# EAGLE design Zio Qwiic RFID Reader_V2.0 (EAGLE 9.3.1)
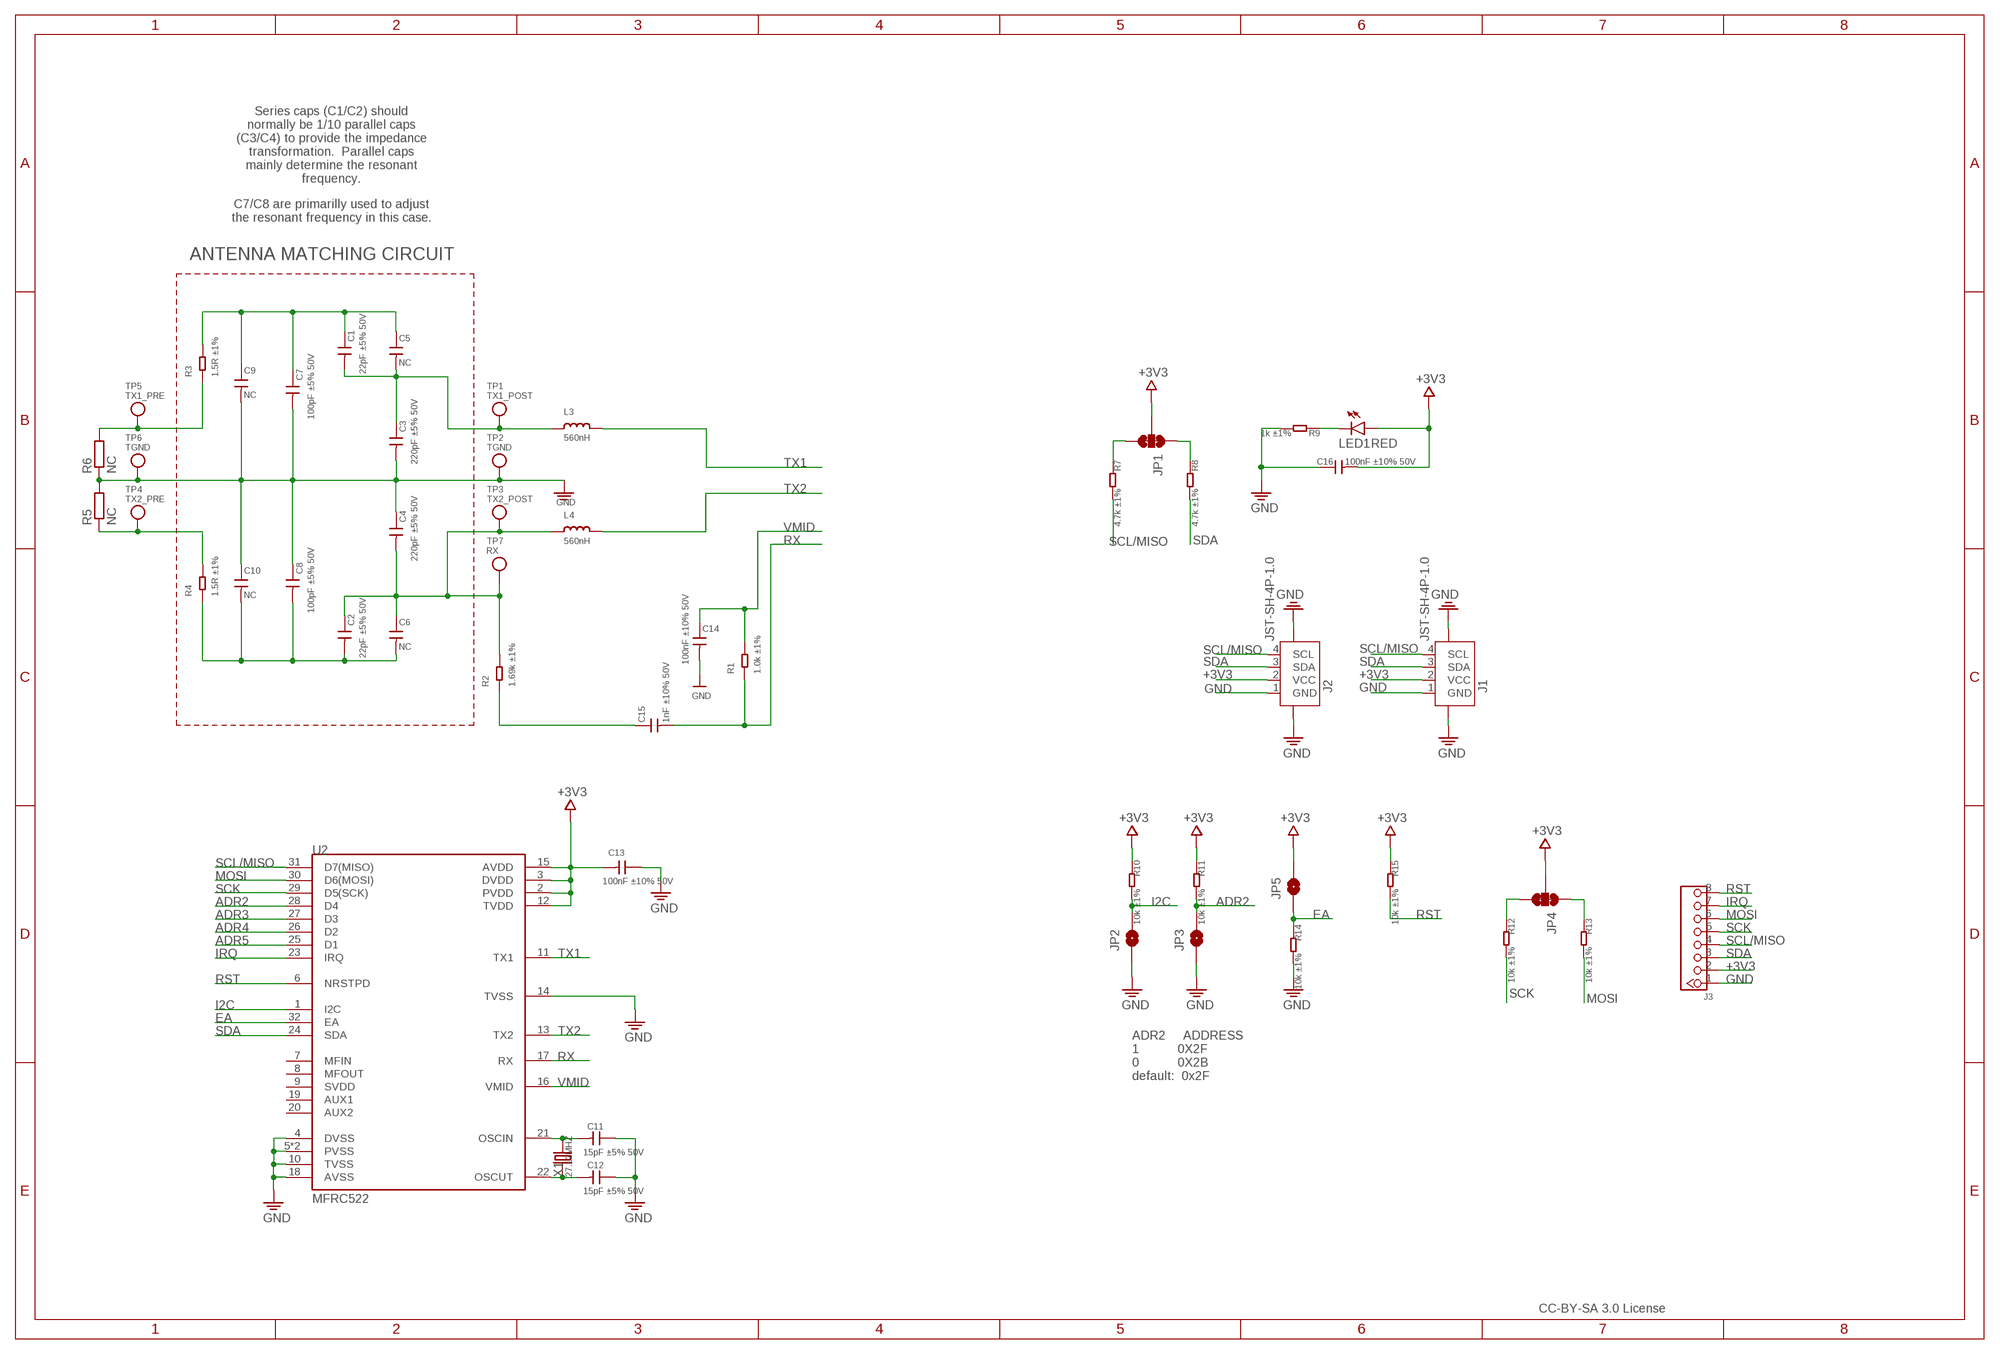
[diagram p0: schematic, sheet 1]

## Parts
C1  22pF ±5% 50V  C-0603  [C0603]
C2  22pF ±5% 50V  C-0603  [C0603]
C3  220pF ±5% 50V  C-0603  [C0603]
C4  220pF ±5% 50V  C-0603  [C0603]
C5  NC  C-0603  [C0603]
C6  NC  C-0603  [C0603]
C7  100pF ±5% 50V  C-0603  [C0603]
C8  100pF ±5% 50V  C-0603  [C0603]
C9  NC  C-0603  [C0603]
C10  NC  C-0603  [C0603]
C11  15pF ±5% 50V  C-0603  [C0603]
C12  15pF ±5% 50V  C-0603  [C0603]
C13  100nF ±10% 50V  C-0603  [C0603]
C14  100nF ±10% 50V  C-0603  [C0603]
C15  1nF ±10% 50V  C-0603  [C0603]
C16  100nF ±10% 50V  C-0603  [C0603]
J1  JST-SH-4P-1.0  [JST-SH-4P]
J2  JST-SH-4P-1.0  [JST-SH-4P]
J3  HEADER-8P-60/35MIL  [8P-2.54-60/35MIL]
JP1  SMT-JUMPER_3_2-NC_TRACE  [SMT-JUMPER_3_2-NC_TRACE]
JP2  JUMPER-SMT_2_NC_PASTE_NOCREM  [SMT-JUMPER_2_NC_PASTE_SILK_NOCREM]
JP3  JUMPER-SMT_2_NC_PASTE_NOCREM  [SMT-JUMPER_2_NC_PASTE_SILK_NOCREM]
JP4  SMT-JUMPER_3_2-NC_TRACE  [SMT-JUMPER_3_2-NC_TRACE]
JP5  JUMPER-SMT_2_NC_PASTE_NOCREM  [SMT-JUMPER_2_NC_PASTE_SILK_NOCREM]
L3  560nH  INDUCTOR0805  [0805]
L4  560nH  INDUCTOR0805  [0805]
LED1  RED  LEDCHIP-LED0603  [CHIP-LED0603]
R1  1.0k ±1%  R-0603  [R0603]
R2  1.69k ±1%  R-0603  [R0603]
R3  1.5R ±1%  R-0603  [R0603]
R4  1.5R ±1%  R-0603  [R0603]
R5  NC  R-EU_R0201  [R0201]
R6  NC  R-EU_R0201  [R0201]
R7  4.7k ±1%  R-0603  [R0603]
R8  4.7k ±1%  R-0603  [R0603]
R9  1k ±1%  R-0603  [R0603]
R10  10k ±1%  R-0603  [R0603]
R11  10k ±1%  R-0603  [R0603]
R12  10k ±1%  R-0603  [R0603]
R13  10k ±1%  R-0603  [R0603]
R14  10k ±1%  R-0603  [R0603]
R15  10k ±1%  R-0603  [R0603]
TP1  TX1_POST  TESTPOINTROUND1MM  [TESTPOINT_ROUND_1MM]
TP2  TGND  TESTPOINTROUND1MM  [TESTPOINT_ROUND_1MM]
TP3  TX2_POST  TESTPOINTROUND1MM  [TESTPOINT_ROUND_1MM]
TP4  TX2_PRE  TESTPOINTROUND1MM  [TESTPOINT_ROUND_1MM]
TP5  TX1_PRE  TESTPOINTROUND1MM  [TESTPOINT_ROUND_1MM]
TP6  TGND  TESTPOINTROUND1MM  [TESTPOINT_ROUND_1MM]
TP7  RX  TESTPOINTROUND1MM  [TESTPOINT_ROUND_1MM]
U1  MFRC522  [HVQFN32]
X1  27.12MHZ  CRYSTAL-HC49UP  [HC49UP]

## Nets
+3V3: C13.2 C16.2 J1.2(VCC) J2.2(VCC) J3.2 JP1.2 JP4.2 JP5.2 LED1.A R10.1 R11.1 R15.1 U1.2(PVDD) U1.3(DVDD) U1.12(TVDD) U1.15(AVDD)
ADR2: JP3.2 R11.2 U1.28(D4)
ADR3: U1.27(D3)
ADR4: U1.26(D2)
ADR5: U1.25(D1)
EA: JP5.1 R14.1 U1.32(EA)
GND: C3.2 C4.1 C7.2 C8.1 C9.2 C10.1 C11.1 C12.1 C13.1 C14.2 C16.1 J1.1(GND) J1.NC1 J1.NC2 J2.1(GND) J2.NC1 J2.NC2 J3.1 JP2.1 JP3.1 R5.2 R6.1 R9.2 R14.2 TP2.P$1 TP6.P$1 U1.4(DVSS) U1.5(PVSS) U1.10(TVSS) U1.14(TVSS) U1.18(AVSS) U1.33(PVSS)
I2C: JP2.2 R10.2 U1.1(I2C)
IRQ: J3.7 U1.23(IRQ)
MOSI: J3.6 R13.2 U1.30(D6(MOSI))
N$1: C12.2 U1.22(OSCUT) X1.1
N$2: C11.2 U1.21(OSCIN) X1.2
N$3: C1.2 C3.1 C5.2 L3.1 TP1.P$1
N$4: R3.1 R6.2 TP5.P$1
N$5: R4.2 R5.1 TP4.P$1
N$6: JP1.3 R7.1
N$9: C15.1 R2.1
N$12: C2.1 C4.2 C6.1 L4.1 R2.2 TP3.P$1 TP7.P$1
N$13: JP1.1 R8.1
N$14: JP4.3 R12.1
N$15: JP4.1 R13.1
N$21: LED1.C R9.1
RST: J3.8 R15.2 U1.6(NRSTPD)
RX: C15.2 R1.1 U1.17(RX)
SCK: J3.5 R12.2 U1.29(D5(SCK))
SCL/MISO: J1.4(SCL) J2.4(SCL) J3.4 R7.2 U1.31(D7(MISO))
SDA: J1.3(SDA) J2.3(SDA) J3.3 R8.2 U1.24(SDA)
TX1: L3.2 U1.11(TX1)
TX1_ANTENNA: C1.1 C5.1 C7.1 C9.1 R3.2
TX2: L4.2 U1.13(TX2)
TX2_ANTENNA: C2.2 C6.2 C8.2 C10.2 R4.1
VMID: C14.1 R1.2 U1.16(VMID)
Unconnected: U1.7(MFIN) U1.8(MFOUT) U1.9(SVDD) U1.19(AUX1) U1.20(AUX2)

## Notes on the sheet
- Series caps (C1/C2) should
  normally be 1/10 parallel caps
  (C3/C4) to provide the impedance
  transformation.  Parallel caps
  mainly determine the resonant
  frequency.
- C7/C8 are primarilly used to adjust
  the resonant frequency in this case.
- ANTENNA MATCHING CIRCUIT
- ADR2     ADDRESS
  1           0X2F
  0           0X2B
  default:  0x2F
- CC-BY-SA 3.0 License

## Library data of the parts
C1-C16 = RCL:C
J1 J2 = Connector:JST-SH-4P
J3 = Connector_NOA:HEADER-8P
JP1 JP4 = NOA-Jumpers:SMT-JUMPER_3_2-NC_TRACE
JP2 JP3 JP5 = NOA-Jumpers:JUMPER-SMT_2_NC_PASTE_NOCREM
L3 L4 = microbuilder:INDUCTOR: Inductors 0603: 10nH Ceramic Inductor - microwire antenna/RF (Digikey: 712-1434-2-ND) 0805: 560nH Ceramic Inductor - RF (Digikey: 553-1047-1-ND) 270nH Ceramic Inductor - Q = 40@250MHz, +-5%, 1 Ohm DC Resistance (Digikey: 535-10506-2-ND) 1007 (2518 Metric) SMT: 10µH 10% 250mOhm 820mA 1007 Inductor (Digikey: 587-2189-1-ND) 22µH 10% 500mOhm 580mA 1007 Inductor (Digikey: 587-2190-1-ND) 47µH 10% 950mOhm 420mA 1007 Inductor (Digikey: 587-2191-1-ND) 47µH 5% 100mOhm 1A 1008 Inductor (Digikey: 732-1816-1-ND) 5.0x5.0mm (Taiyo Yuden NR5040 Series) 6.8µH 20% 2.3A 64mOhm Inductor (Digikey: 587-2374-2-ND) 5.0x5.0mm (TDK VLC5045 Series) 4.7µH 20% 3.3A 34mOhm Inductor (Digikey: 445-6526-1-ND) 6.8µH 20% 2.7A 46mOhm Inductor (Digikey: 445-6527-1-ND) 6.0x6.0mm (TDK VLC6045 Series) 4.7µH 20% 3.8A 27mOhm Inductor (Digikey: 445-6538-2-ND) 6.8µH 20% 3A 41mOhm Inductor (Digikey: 445-6540-1-ND) 6.2µH 30% 2.2A 45mOhm Inductor (Digikey: SRR5028-6R2YCT-ND) - Not TDK VLC6045 but footprint should match 6.0x6.0mm (TDK SLF6045 Series) 6.8uH 30% 2A 33mOhm Inductor (Digikey: 445-4572-1-ND, Mouser: 810-SLF645T6R8N2R0PF) 6.0x6.0mm (Sumida CDRH5D28 Series) 6.2uH 30% 1.8A 45mOhm Inductor (Digikey: 308-1542-1-ND) Taiyo Yuden NR3015T2R2M - 2.2uH 20% 1.5A (Digikey: 587-1648-2-ND, Mouser: 963-NR3015T2R2M) - Used with TI TPS62172 CoilCraft RFID Transponder Coil - MA5532-AE (For use with AS3935 Lightning Sensor)
LED1 = led:LED: LED OSRAM: - CHIPLED LG R971, LG N971, LY N971, LG Q971, LY Q971, LO R971, LY R971 LH N974, LH R974 LS Q976, LO Q976, LY Q976 LO Q996 - Hyper CHIPLED LW Q18S LB Q993, LB Q99A, LB R99A - SideLED LS A670, LO A670, LY A670, LG A670, LP A670 LB A673, LV A673, LT A673, LW A673 LH A674 LY A675 LS A676, LA A676, LO A676, LY A676, LW A676 LS A679, LY A679, LG A679 - Hyper Micro SIDELED® LS Y876, LA Y876, LO Y876, LY Y876 LT Y87S - SmartLED LW L88C, LW L88S LB L89C, LB L89S, LG L890 LS L89K, LO L89K, LY L89K LS L896, LA L896, LO L896, LY L896 - TOPLED LS T670, LO T670, LY T670, LG T670, LP T670 LSG T670, LSP T670, LSY T670, LOP T670, LYG T670 LG T671, LOG T671, LSG T671 LB T673, LV T673, LT T673, LW T673 LH T674 LS T676, LA T676, LO T676, LY T676, LB T676, LH T676, LSB T676, LW T676 LB T67C, LV T67C, LT T67C, LS T67K, LO T67K, LY T67K, LW E67C LS E67B, LA E67B, LO E67B, LY E67B, LB E67C, LV E67C, LT E67C LW T67C LS T679, LY T679, LG T679 LS T770, LO T770, LY T770, LG T770, LP T770 LB T773, LV T773, LT T773, LW T773 LH T774 LS E675, LA E675, LY E675, LS T675 LS T776, LA T776, LO T776, LY T776, LB T776 LHGB T686 LT T68C, LB T68C - Hyper Mini TOPLED® LB M676 - Mini TOPLED Santana® LG M470 LS M47K, LO M47K, LY M47K Source: http://www.osram.convergy.de LUXEON: - LUMILED® LXK2-PW12-R00, LXK2-PW12-S00, LXK2-PW14-U00, LXK2-PW14-V00 LXK2-PM12-R00, LXK2-PM12-S00, LXK2-PM14-U00 LXK2-PE12-Q00, LXK2-PE12-R00, LXK2-PE12-S00, LXK2-PE14-T00, LXK2-PE14-U00 LXK2-PB12-K00, LXK2-PB12-L00, LXK2-PB12-M00, LXK2-PB14-N00, LXK2-PB14-P00, LXK2-PB14-Q00 LXK2-PR12-L00, LXK2-PR12-M00, LXK2-PR14-Q00, LXK2-PR14-R00 LXK2-PD12-Q00, LXK2-PD12-R00, LXK2-PD12-S00 LXK2-PH12-R00, LXK2-PH12-S00 LXK2-PL12-P00, LXK2-PL12-Q00, LXK2-PL12-R00 Source: www.luxeon.com KINGBRIGHT: KA-3528ASYC Source: www.kingbright.com
R1-R4 R7-R15 = RCL:R
R5 R6 = rcl:R-EU_: RESISTOR, European symbol
TP1-TP7 = microbuilder:TESTPOINT: Test Point Various test points for characterisation and PCB testing TESTPOINT_SMT - Compact Surface Mount Test Point [Digikey: 5016KTR-ND]
U1 = IC:MFRC522
X1 = Discrete_NOA:CRYSTAL*: CRYSTAL

## Net classes
0 default: clearance 0.205 mm

## Board
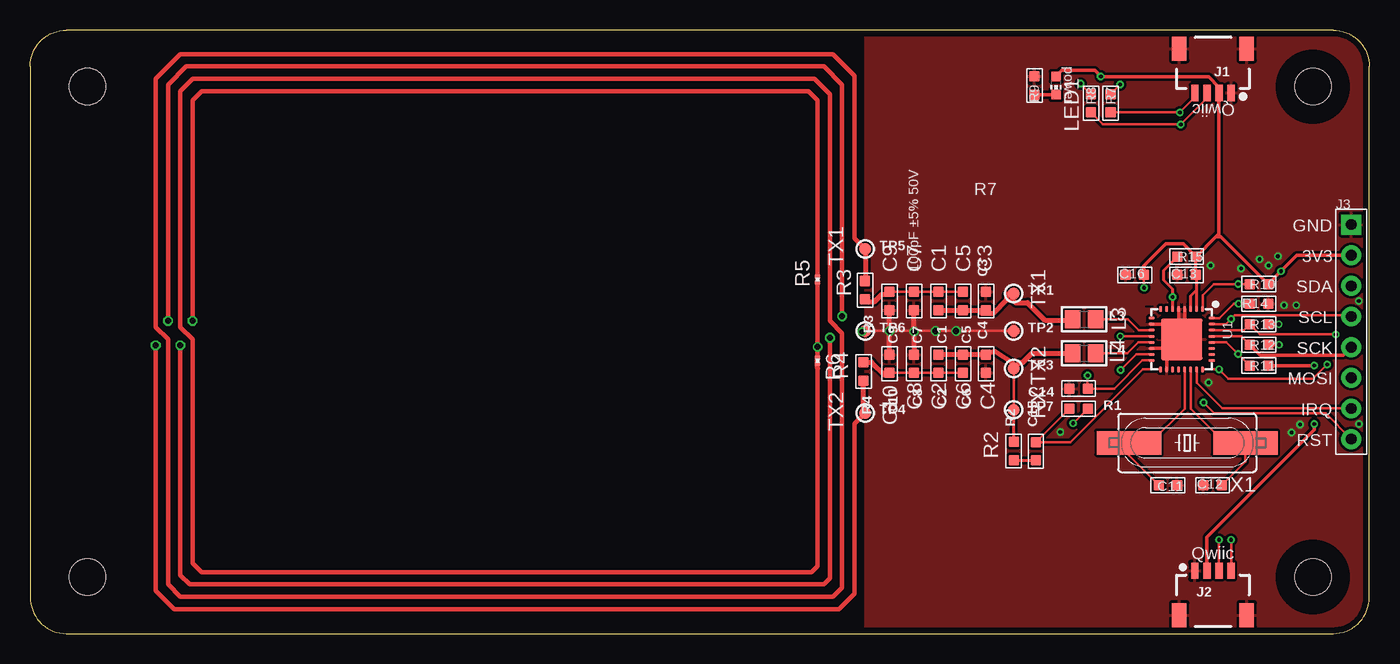
[diagram p1: board, top side]
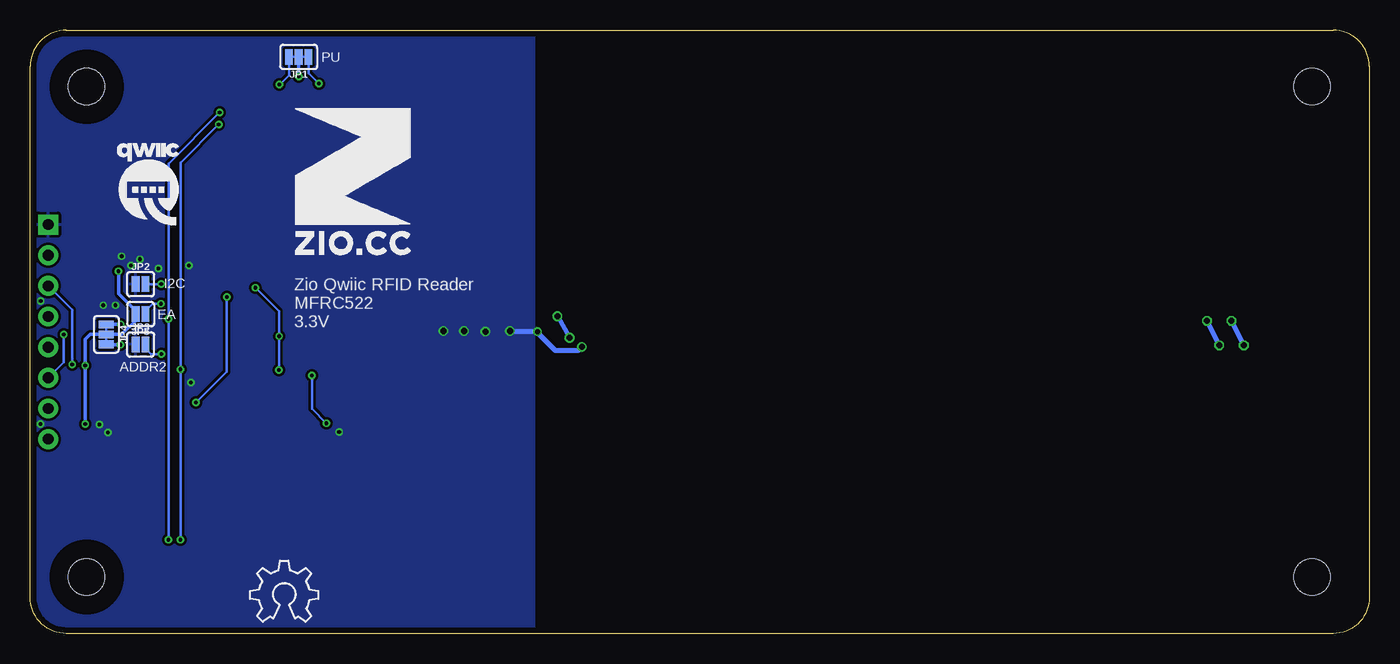
[diagram p2: board, bottom side, seen from below]

Size 111.02 x 50 mm. Coordinates in mm from the lower left corner, seen from the top.
Outline: 108.02,50 3,50 arc90 0,47 0,3 arc90 3,0 108.02,0 arc90 111.02,3 111.02,47 arc90 108.02,50
Copper layers (1*16): Top 0.035mm / dielectric 1.5mm / Bottom 0.035mm
Design rules "NOA Eagle Rule": minimum track width 7mil, minimum drill 12mil, track to track 7mil, track to pad 7mil, pad to pad 7mil, via to via 7mil, smd to smd 0mil, copper to edge 20mil, drill to drill 10mil, minimum pad ring 10mil, minimum via ring 6mil, stop-mask expansion 2mil, vias tented up to drill 25mil, thermal gap 10mil
Holes 3 mm at 4.74,4.68 4.74,45.32 106.34,4.68 106.34,45.32
tRestrict: area 92.5,27.1 to 93.1,27.2; area 93.5,24.4 to 93.7,24.9; area 95.5,26.7 to 96,26.9; area 97.8,24.4 to 98,24.9; area 95.2,22.4 to 96.3,22.6; area 103.3,1.7 to 109.3,7.7; area 103.3,42.3 to 109.3,48.3
bRestrict: area 9.1,26.9 to 14.2,28.2; area 9.1,22.1 to 14.2,23.4; area 14.7,6.3 to 64,44.2; area 103.3,1.7 to 109.3,7.7; area 103.3,42.3 to 109.3,48.3

### Footprints (pad centres in the part's own frame; a part is rotated, then mirrored left to right if it is on the bottom)
C0603 = smd 0.889 x 0.889: 1 -0.762,0; 2 0.762,0
JST-SH-4P = smd 0.6 x 1.35: 1 1.5,0; 2 0.5,0; 3 -0.5,0; 4 -1.5,0 | smd 1.2 x 2: NC1 -2.8,3.675; NC2 2.8,3.675
8P-2.54-60/35MIL = drill 0.889 pad 1.651 square: 1 0,8.89 | drill 0.889 pad 1.651: 2 0,6.35; 3 0,3.81; 4 0,1.27; 5 0,-1.27; 6 0,-3.81; 7 0,-6.35; 8 0,-8.89
SMT-JUMPER_3_2-NC_TRACE = smd 0.635 x 1.27: 1 -0.813,0; 2 0,0; 3 0.813,0
SMT-JUMPER_2_NC_PASTE_SILK_NOCREM = smd 0.635 x 1.27: 1 -0.406,0; 2 0.406,0
0805 = smd 1.3 x 1.5: 1 -0.95,0; 2 0.95,0
CHIP-LED0603 = smd 0.8 x 0.8: A 0,-0.75; C 0,0.75
R0603 = smd 0.889 x 0.889: 1 -0.762,0; 2 0.762,0
R0201 = smd 0.28 x 0.43: 1 -0.255,0; 2 0.255,0
TESTPOINT_ROUND_1MM = smd 1 x 1: P$1 0,0
HVQFN32 = smd 0.5 x 0.25: 1 -2.5,1.75; 2 -2.5,1.25; 3 -2.5,0.75; 4 -2.5,0.25; 5 -2.5,-0.25; 6 -2.5,-0.75; 7 -2.5,-1.25; 8 -2.5,-1.75; 17 2.5,-1.75; 18 2.5,-1.25; 19 2.5,-0.75; 20 2.5,-0.25; 21 2.5,0.25; 22 2.5,0.75; 23 2.5,1.25; 24 2.5,1.75 | smd 0.25 x 0.5: 9 -1.75,-2.5; 10 -1.25,-2.5; 11 -0.75,-2.5; 12 -0.25,-2.5; 13 0.25,-2.5; 14 0.75,-2.5; 15 1.25,-2.5; 16 1.75,-2.5; 25 1.75,2.5; 26 1.25,2.5; 27 0.75,2.5; 28 0.25,2.5; 29 -0.25,2.5; 30 -0.75,2.5; 31 -1.25,2.5; 32 -1.75,2.5 | smd 3.45 x 3.45: 33 0,0
HC49UP = smd 5.334 x 1.93: 1 -4.826,0; 2 4.826,0

### Placement (x,y rotation side)
C1  75.31,27.55 270 top
C2  75.31,22.36 270 top
C3  79.24,27.55 90 top
C4  79.24,22.36 90 top
C5  77.33,27.55 270 top
C6  77.33,22.36 270 top
C7  73.28,27.55 270 top
C8  73.28,22.36 270 top
C9  71.25,27.55 270 top
C10  71.25,22.36 270 top
C11  94.32,12.29 180 top
C12  98.02,12.29 0 top
C13  95.86,29.72 0 top
C14  86.91,20.3 180 top
C15  83.38,15.11 90 top
C16  91.57,29.72 0 top
J1  98.06,44.8 0 top
J2  98.06,5.2 180 top
J3  109.52,25 0 top
JP1  88.75,47.78 180 bottom
JP2  101.86,28.96 0 bottom
JP3  101.86,23.95 0 bottom
JP4  104.7,24.79 270 bottom
JP5  101.86,26.47 180 bottom
L3  87.38,26.04 0 top
L4  87.38,23.24 0 top
LED1  85.04,45.42 180 top
R1  86.91,18.63 0 top
R2  81.53,15.12 90 top
R3  69.22,28.45 270 top
R4  69.1,21.71 270 top
R5  65.28,29.34 90 top
R6  65.28,22.61 270 top
R7  89.57,43.94 270 top
R8  87.94,43.94 270 top
R9  83.27,45.42 90 top
R10  101.86,28.96 180 top
R11  101.86,22.2 180 top
R12  101.86,23.93 180 top
R13  101.86,25.63 180 top
R14  101.86,27.33 0 top
R15  95.86,31.24 180 top
TP1  81.53,28.18 0 top
TP2  81.53,25.07 0 top
TP3  81.53,21.97 0 top
TP4  69.22,18.29 0 top
TP5  69.22,31.86 0 top
TP6  69.23,25.07 0 top
TP7  81.53,18.54 0 top
U1  95.46,24.38 270 top
U$7  [12MM]  89.13,31.32 0 bottom
U$10  [QWIIC-LOGO-MEDIUM]  101.25,37.29 0 bottom
U$13  [OSHW_6X200_NOTEXT]  92.79,0.97 0 bottom
X1  95.92,15.8 180 top

### Tracks (layer width: path | path; a pad name or v marks a point on that pad's centre or on a via)
+3V3  (via drill 0.3)
  Top 0.203: U1.15 91.69,23.13 v90.4,21.84 | U1.12 v90.38,24.63 v90.38,24.64 | v92.33,28.65 C16.2
  Top 0.254: U1.2 96.71,28.47 | 96.71,28.47 96.71,29.64 C13.2 96.63,31.19 R15.1 | U1.3 96.21,27.97 96.71,28.47
  Top 0.305: C16.2 92.33,30.48 94.14,32.28 95.58,32.28 R15.1 | J3.2 105.02,31.35 v103.69,30.02 R10.1 98.71,32.87 | 98.56,33.12 J1.2 98.56,45.29 97.69,46.15 v88.75,46.15 88.24,46.66 85.54,46.66 LED1.A | 98.56,33.12 98.3,32.87 | 98.3,32.87 96.63,31.19 | 98.71,32.87 98.56,33.02 98.56,33.12 | 98.71,32.87 98.3,32.87 | J2.2 97.56,7.99 106.46,16.89 v106.46,17.37 | R11.1 v106.46,22.2
  Bottom 0.203: v90.4,21.84 90.38,21.87 v90.38,24.64 90.38,26.7 v92.33,28.65
  Bottom 0.305: v103.69,30.02 103.69,28.17 102.27,26.75 JP5.2 102.27,25.93 103.41,24.79 JP4.2 106.05,24.79 106.46,24.38 v106.46,22.2 v106.46,17.37 | JP1.2 v88.75,46.15
ADR2  (via drill 0.3)
  Top 0.203: U1.28 99.16,24.13 v100.14,23.15 R11.2
  Bottom 0.203: JP3.2 101.45,23.62 100.98,23.15 v100.14,23.15
EA  (via drill 0.3)
  Top 0.203: U1.32 98.58,26.13 99.78,27.33 v100.18,27.33 R14.1
  Bottom 0.203: JP5.1 101.45,26.75 100.87,27.33 v100.18,27.33
GND  (via drill 0.3, 0.4, 0.5)
  Top 0.203: TP6.P$1 73.28,25.07 TP2.P$1
  Top 0.305: U1.10 95.46,25.63 U1.33 | U1.5 95.21,24.38 U1.33 | U1.4 95.71,24.38 U1.33 | U1.14 95.46,23.63 U1.33 | U1.18 94.21,23.13 U1.33
  Top 0.356: R5.2 v65.28,23.75 R6.1
  Top 0.406: C8.1 73.28,25.07 C7.2 | C10.1 C9.2 | 65.28,21.97 R6.1
  Bottom 0.406: v65.28,23.75 65.58,23.44 67.47,23.44 68.96,24.94 v68.96,25.02 71.2,25.02 v71.25,25.07
  other vias: 73.28,25.02 75.06,25.07 76.76,25.07 103.94,27.2 104.96,27.2 102.67,30.51 103.43,31.27 101.91,31.01 100.39,30.25 97.85,30.51 110.14,27.56 97.69,20.8 85.4,16.69 105.26,17.32 104.58,16.66 110.16,17.37
  pour Top (isolate 0.406): 80.01,26.42 83.31,26.42 83.31,23.37 80.01,23.37
  pour Top: 69.25,49.99 111.08,49.99 111.08,0.03 69.25,0.03
  pour Bottom: 69.25,49.99 111.08,49.99 111.08,0.03 69.25,0.03
I2C  (via drill 0.3)
  Top 0.203: U1.1 97.21,28.04 98.12,28.96 v100.16,28.96 R10.2
  Bottom 0.203: JP2.2 v100.16,28.96
IRQ
  Top 0.203: U1.23 96.71,20.77 98.83,18.65 J3.7
MOSI  (via drill 0.3)
  Top 0.203: U1.30 100.6,25.13 R13.2 101.94,24.79 v108.23,24.79
  Bottom 0.203: v108.23,24.79 108.23,22.47 J3.6
N$1
  Top 0.203: U1.22 96.21,18.63 99.04,15.8 X1.1 100.74,14.25 C12.2
N$2
  Top 0.203: U1.21 95.71,18.64 92.87,15.8 X1.2 91.09,14.76 C11.2
N$3
  Top 0.203: C1.2 C5.2 | 86.36,25.97 L3.1 | 80.98,27.64 81.53,27.64 81.53,27.56
  Top 0.406: TP1.P$1 80.98,28.13 80.98,27.64 79.88,26.54 78.83,26.54 C3.1 C1.2 | 86.36,25.97 84.13,25.97 82.68,27.43 81.66,27.43 81.53,27.56
N$4
  Top 0.356: TP5.P$1 68.33,32.75 68.33,46.22 66.55,48.01 12.45,48.01 10.41,45.97 10.41,25.4 11.43,24.38 11.43,4.06 12.45,3.05 66.55,3.05 67.31,3.81 67.31,24.89 66.29,25.91 66.29,44.7 65.02,45.97 13.46,45.97 12.45,44.96 12.45,25.4 13.46,24.38 13.46,5.84 14.22,5.08 64.77,5.08 65.28,5.59 R6.2
  Top 0.406: TP5.P$1 69.22,29.41 R3.1
N$5  (via drill 0.5)
  Top 0.356: v10.41,23.88 10.41,3.56 11.94,2.03 67.06,2.03 68.33,3.31 68.33,17.4 TP4.P$1 | v11.43,25.91 11.43,45.47 12.95,46.99 65.79,46.99 67.31,45.47 v67.31,26.29 | v66.29,24.51 66.29,4.57 65.79,4.06 13.21,4.06 12.45,4.83 v12.45,23.88 | v13.46,25.91 13.46,44.2 14.22,44.96 64.52,44.96 65.28,44.2 R5.1 65.28,28.96
  Top 0.406: R4.2 69.1,18.41 TP4.P$1
  Bottom 0.406: v11.43,25.91 v10.41,23.88 | v67.31,26.29 v66.29,24.51 | v12.45,23.88 v13.46,25.91
N$6  (via drill 0.3)
  Top 0.203: R7.1 v90.35,45.49
  Bottom 0.203: JP1.3 89.57,46.28 v90.35,45.49
N$9
  Top 0.254: R2.1 81.54,14.35 C15.1
N$12
  Top 0.203: TP7.P$1 TP3.P$1
  Top 0.254: R2.2 TP7.P$1
  Top 0.406: C2.1 C6.1 C4.2 78.57,23.12 80.01,23.37 81.53,22.35 TP3.P$1 82.04,22.48 82.3,22.48 83.06,23.24 L4.1
N$13  (via drill 0.3)
  Top 0.203: R8.1 v87.08,45.57
  Bottom 0.203: JP1.1 87.94,46.43 v87.08,45.57
N$14  (via drill 0.3)
  Top 0.305: R12.1 v103.54,23.93
  Bottom 0.305: JP4.3 104.65,23.93 v103.54,23.93
N$15  (via drill 0.3)
  Top 0.305: R13.1 v103.51,25.63
  Bottom 0.305: JP4.1 104.68,25.63 v103.51,25.63
N$21
  Top 0.305: R9.1 85.03,44.65 LED1.C
RST  (via drill 0.3)
  Top 0.203: J3.8 107.38,18.24 98.17,18.24 v97.26,19.15
  Top 0.254: U1.6 v94.71,27.89 94.71,28.54 93.98,29.26 93.98,30.12 R15.2
  Bottom 0.203: v97.26,19.15 94.71,21.7 v94.71,27.89
RX
  Top 0.203: U1.17 92.24,21.88 86.23,15.87 C15.2 83.39,15.87 R1.1
SCK
  Top 0.203: U1.29 100.39,24.63 R12.2
  Top 0.305: R12.2 101.96,23.06 108.85,23.06 J3.5
SCL/MISO  (via drill 0.3)
  Top 0.203: U1.31 99.12,25.63 v99.55,26.06 99.87,26.38 109.41,26.38 J3.4 | J1.4 96.56,44.43 v95.31,43.18 R7.2 | J2.4 v99.56,7.76 v99.55,7.77
  Bottom 0.203: v95.31,43.18 99.55,38.94 v99.55,26.06 99.55,23.42 99.53,23.41 99.53,22.9 99.55,22.88 v99.55,7.77
SDA  (via drill 0.3)
  Top 0.203: J1.3 97.56,44.34 95.41,42.19 v95.38,42.19 88.93,42.19 R8.2 | J2.3 v98.56,7.77 | U1.24 v98.55,21.88 v98.56,21.89 99.34,21.11 106.33,21.11 v107.52,22.3
  Bottom 0.203: v98.56,7.77 v98.56,21.89 98.56,39.01 v95.38,42.19 | v107.52,22.3 107.52,26.82 J3.3
TX1
  Top 0.203: L3.2 91.01,26.04 91.91,25.13 U1.11
TX1_ANTENNA
  Top 0.203: C9.1 C7.1 C1.1 C5.1
  Top 0.406: C9.1 71.2,28.1 70.61,28.1 70,27.5 69.22,27.5 R3.2
TX2
  Top 0.203: U1.13 91.86,24.13 90.96,23.24 L4.2
TX2_ANTENNA
  Top 0.203: C10.2 C8.2 C2.2 C6.2
  Top 0.406: C10.2 70.84,21.41 69.75,22.5 69.26,22.5 R4.1
VMID  (via drill 0.3)
  Top 0.203: U1.16 92.2,22.63 89.87,20.3 C14.1 87.66,20.32 v87.66,21.39 | R1.2 v86.47,17.42
  Bottom 0.203: v86.47,17.42 87.66,18.62 v87.66,21.39

### Text on the board
tPlace: power | Qwiic | GND | 3V3 | SDA | SCL | SCK | MOSI | IRQ | RST | Qwiic
bPlace: PU | I2C | EA | Zio Qwiic RFID Reader / MFRC522 / 3.3V | ADDR2
tNames: R7 | TX1 | C9 | C7 | C1 | C5 | C3 | R3 | TX1 | L3 | L4 | R4 | TX2 | C8 | C2 | C6 | C4 | RX | TX2 | C10 | R2